# EAGLE design USB_Adapter_V1 (EAGLE 6.5.0)
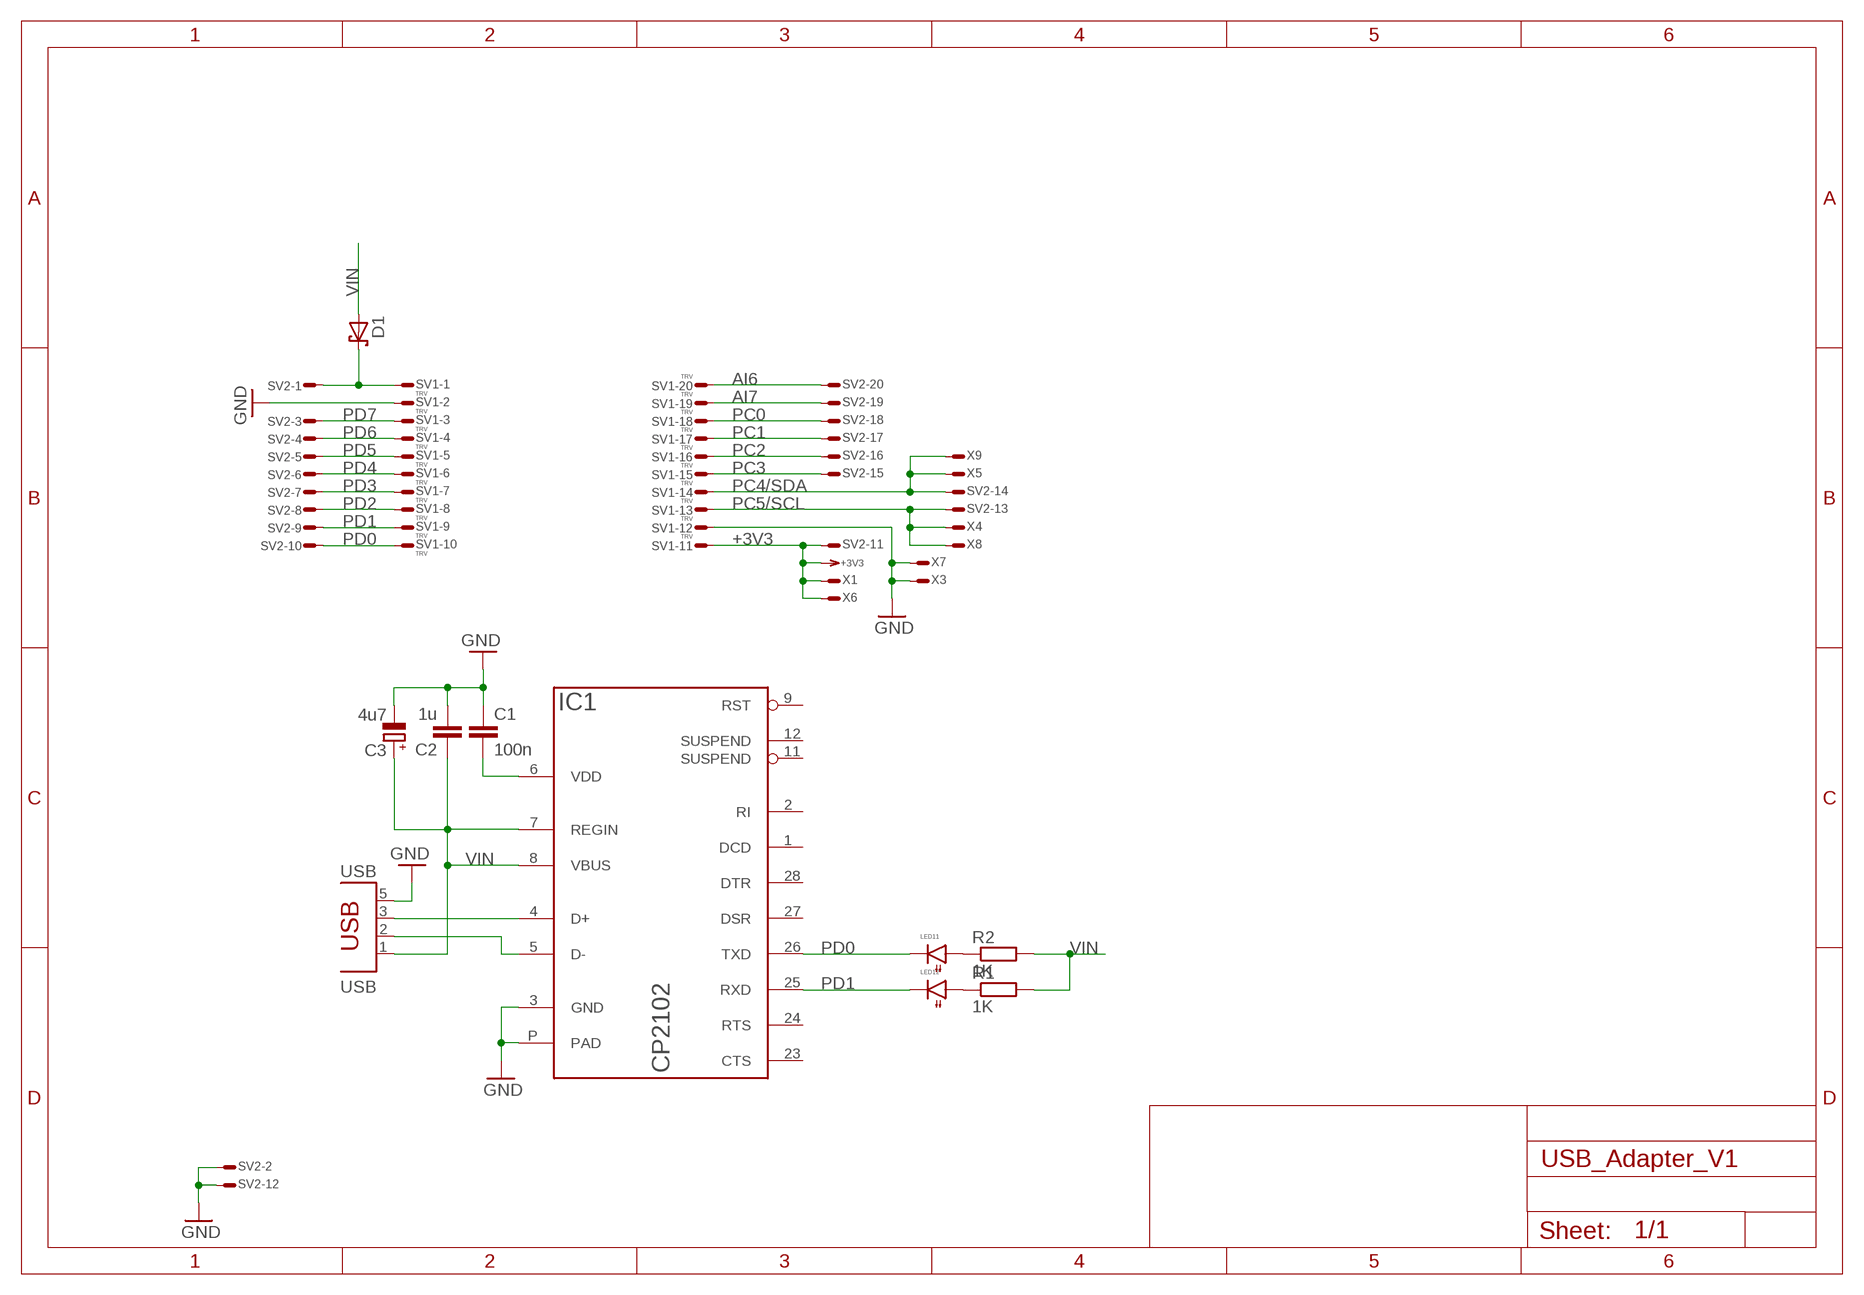
[diagram p0: schematic, sheet 1]

## Parts
C1  100n  C0603  [0603]
C2  1u  C0603  [0603]
C3  4u7  C_POLSMCA  [SMC_A]
D1  D-SCHOTKY323  [SOD323]
IC1  CP2102  [QFN28]
LED1  2LED3  [HSMF]
R1  1K  R0603  [0603]
R2  1K  R0603  [0603]
SV1  TRV  FE20ELSS  [FE10-2WSS]
SV2  ML20SE  [ML20S]
USB  USB  USBBM  [USB-BM]
X1  WIREPADT1.6/0.9  [T1.6/0.9]
X3  WIREPADT1.6/0.9  [T1.6/0.9]
X4  WIREPADT1.6/0.9  [T1.6/0.9]
X5  WIREPADT1.6/0.9  [T1.6/0.9]
X6  WIREPADT1.6/0.9  [T1.6/0.9]
X7  WIREPADT1.6/0.9  [T1.6/0.9]
X8  WIREPADT1.6/0.9  [T1.6/0.9]
X9  WIREPADT1.6/0.9  [T1.6/0.9]

## Nets
+3V3: SV1.P$11 SV2.11 X1.1(S) X6.1(S)
AI6: SV1.P$20 SV2.20
AI7: SV1.P$19 SV2.19
GND: C1.1 C2.2 C3.- IC1.3(GND) IC1.P(PAD) SV1.P$2 SV1.P$12 SV2.2 SV2.12 USB.5(GND) X3.1(S) X7.1(S)
N$1: D1.C SV1.P$1 SV2.1
N$2: C1.2 IC1.6(VDD)
N$3: LED1.3(2:A) R1.1
N$4: IC1.4(D+) USB.3(D+)
N$5: LED1.1(1:A) R2.1
N$6: IC1.5(D-) USB.2(D-)
PC0: SV1.P$18 SV2.18
PC1: SV1.P$17 SV2.17
PC2: SV1.P$16 SV2.16
PC3: SV1.P$15 SV2.15
PC4/SDA: SV1.P$14 SV2.14 X5.1(S) X9.1(S)
PC5/SCL: SV1.P$13 SV2.13 X4.1(S) X8.1(S)
PD0: IC1.26(TXD) LED1.2(1:C) SV1.P$10 SV2.10
PD1: IC1.25(RXD) LED1.4(2:C) SV1.P$9 SV2.9
PD2: SV1.P$8 SV2.8
PD3: SV1.P$7 SV2.7
PD4: SV1.P$6 SV2.6
PD5: SV1.P$5 SV2.5
PD6: SV1.P$4 SV2.4
PD7: SV1.P$3 SV2.3
VIN: C2.1 C3.+ D1.A IC1.7(REGIN) IC1.8(VBUS) R1.2 R2.2 USB.1(VCC)
Unconnected: IC1.1(DCD) IC1.2(RI) IC1.9(RST) IC1.11(SUSPEND) IC1.12(SUSPEND) IC1.23(CTS) IC1.24(RTS) IC1.27(DSR) IC1.28(DTR)

## Library data of the parts
C1 C2 = RCL:C: Capacitor SMD
C3 = RCL:C_POL: POLARIZED CAPACITOR, European symbol
D1 = Diode:D-SCHOTKY: Schottky Diode
IC1 = ICs:CP2102
LED1 = Optic:2LED
R1 R2 = RCL:R: Resistor SMD
SV1 = Conn:FE20E
SV2 = Conn:ML20?E: HARTING
USB = Conn:USB: BERG USB connector
X1 X3-X9 = Conn:WIREPAD: Wire PAD connect wire on PCB

## Board
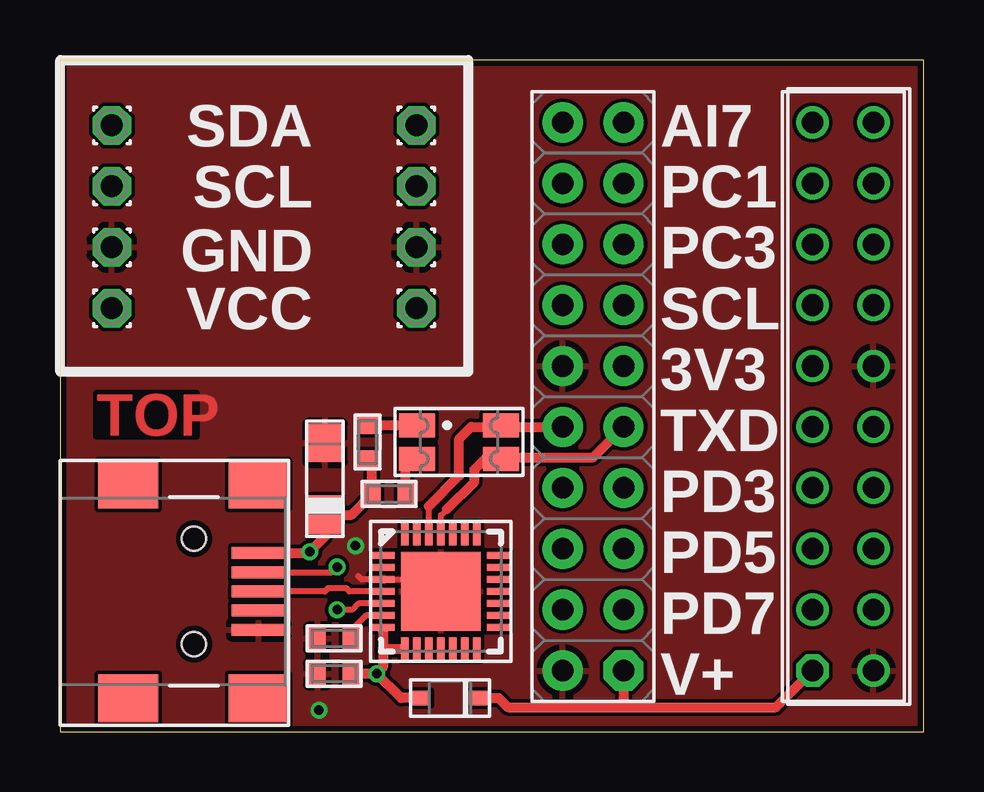
[diagram p1: board, top side]
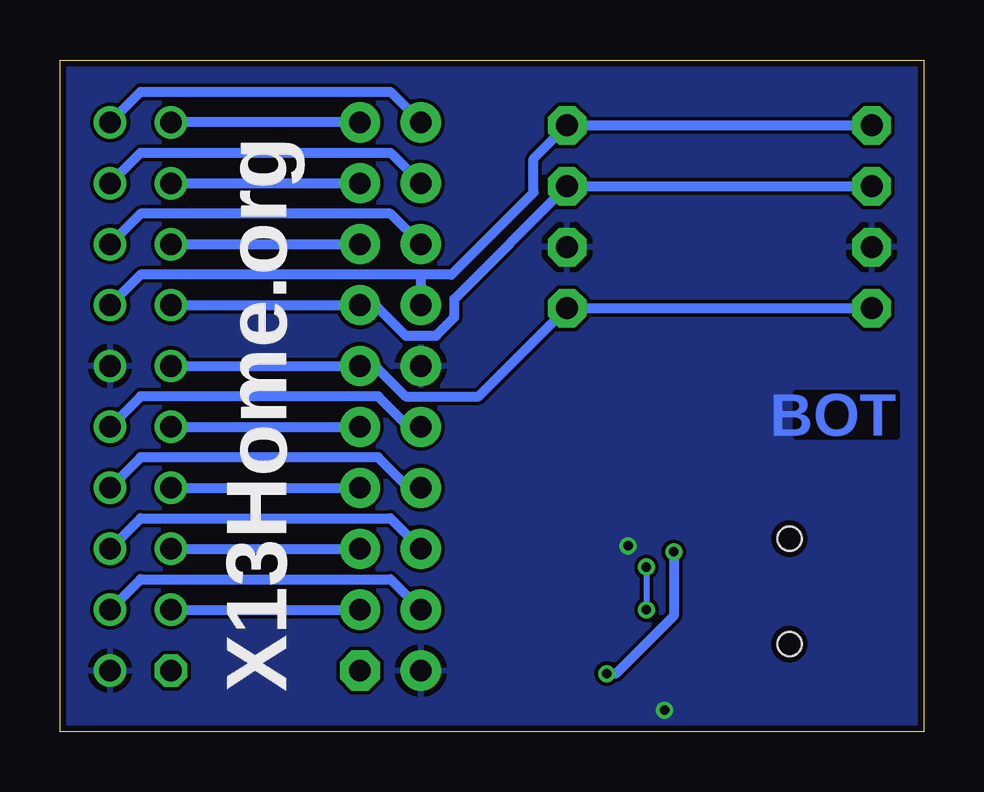
[diagram p2: board, bottom side, seen from below]

Size 36 x 28 mm. Coordinates in mm from the lower left corner, seen from the top.
Outline: 0,28 0,0 36,0 36,28 0,28
Copper layers (1*16): Top 0.035mm / dielectric 0.2mm / Bottom 0.035mm
Design rules "SeeedStudio_DRU_no_angle_20130527 *": minimum track width 6mil, minimum drill 12mil, track to track 6mil, track to pad 6mil, pad to pad 6mil, via to via 6mil, smd to smd 0mil, copper to edge 10mil, drill to drill 10mil, minimum pad ring 6mil, minimum via ring 6mil, stop-mask expansion 2mil, vias tented up to drill 25mil, thermal gap 10mil

### Footprints (pad centres in the part's own frame; a part is rotated, then mirrored left to right if it is on the bottom)
0603 = smd 0.7 x 0.9: 1 -0.697,0; 2 0.697,0
SMC_A = smd 1.6 x 1.4: + -1.5,0; - 1.5,0
SOD323 = smd 0.8 x 0.6: A 1.2,0; C -1.2,0
QFN28 = smd 0.95 x 0.3: 1 -2.4,1.5; 2 -2.4,1; 3 -2.4,0.5; 4 -2.4,0; 5 -2.4,-0.5; 6 -2.4,-1; 7 -2.4,-1.5; 15 2.4,-1.5; 16 2.4,-1; 17 2.4,-0.5; 18 2.4,0; 19 2.4,0.5; 20 2.4,1; 21 2.4,1.5 | smd 0.3 x 0.95: 8 -1.5,-2.4; 9 -1,-2.4; 10 -0.5,-2.4; 11 0,-2.4; 12 0.5,-2.4; 13 1,-2.4; 14 1.5,-2.4; 22 1.5,2.4; 23 1,2.4; 24 0.5,2.4; 25 0,2.4; 26 -0.5,2.4; 27 -1,2.4; 28 -1.5,2.4 | smd 3.3 x 3.3: P 0,0
HSMF = smd 1 x 1.5: 1 -0.7,-1.75; 2 -0.7,1.75; 3 0.7,-1.75; 4 0.7,1.75
FE10-2WSS = drill 0.9 octagon: P$1 -11.43,1.27 | drill 0.9: P$2 -11.43,-1.27; P$3 -8.89,1.27; P$4 -8.89,-1.27; P$5 -6.35,1.27; P$6 -6.35,-1.27; P$7 -3.81,1.27; P$8 -3.81,-1.27; P$9 -1.27,1.27; P$10 -1.27,-1.27; P$11 1.27,1.27; P$12 1.27,-1.27; P$13 3.81,1.27; P$14 3.81,-1.27; P$15 6.35,1.27; P$16 6.35,-1.27; P$17 8.89,1.27; P$18 8.89,-1.27; P$19 11.43,1.27; P$20 11.43,-1.27
ML20S = drill 0.9 pad 1.676 octagon: 1 -11.43,-1.27 | drill 0.9 pad 1.676: 2 -11.43,1.27; 3 -8.89,-1.27; 4 -8.89,1.27; 5 -6.35,-1.27; 6 -6.35,1.27; 7 -3.81,-1.27; 8 -3.81,1.27; 9 -1.27,-1.27; 10 -1.27,1.27; 11 1.27,-1.27; 12 1.27,1.27; 13 3.81,-1.27; 14 3.81,1.27; 15 6.35,-1.27; 16 6.35,1.27; 17 8.89,-1.27; 18 8.89,1.27; 19 11.43,-1.27; 20 11.43,1.27
USB-BM = smd 0.5 x 2.25: 1 -1.6,2.7; 2 -0.8,2.7; 3 0,2.7; 4 0.8,2.7; 5 1.6,2.7 | smd 2 x 2.5: E1 -4.45,-2.75; E2 4.45,-2.75; E3 -4.45,2.7; E4 4.45,2.7 | hole 1: -2.2,0; 2.2,0
T1.6/0.9 = drill 0.914 pad 1.6 octagon: 1 0,0

### Placement (x,y rotation side)
C1  11.43,3.88 0 top
C2  11.43,2.41 180 top
C3  11.05,10.54 90 top
D1  16.26,1.4 180 top
IC1  15.88,5.84 0 top
LED1  16.64,12.06 270 top
R1  13.72,9.91 180 top
R2  12.83,12.06 270 top
SV1  32.64,13.97 90 top
SV2  22.23,13.97 90 top
USB  5.59,5.84 270 top
X1  14.86,17.65 180 top
X3  14.86,20.19 180 top
X4  14.86,22.73 180 top
X5  14.86,25.27 180 top
X6  2.16,17.65 0 top
X7  2.16,20.19 0 top
X8  2.16,22.73 0 top
X9  2.16,25.27 0 top

### Tracks (layer width: path | path; a pad name or v marks a point on that pad's centre or on a via)
+3V3
  Bottom 0.406: SV1.P$11 SV2.11 22.86,15.24 21.59,13.97 18.54,13.97 X1.1 X6.1
AI6
  Bottom 0.406: SV1.P$20 32.64,26.67 22.23,26.67 SV2.20
AI7
  Bottom 0.406: SV2.19 SV1.P$19
GND  (via drill 0.4)
  Top 0.254: IC1.P 15.38,6.34 IC1.3 12.58,6.34 12.45,6.48
  other vias: 10.79,0.89 12.32,7.75
  pour Bottom: 0,28 0,0 36,0 36,28
  pour Top: 0,28 0,0 36,0 36,28
N$1
  Top 0.406: D1.C 18.29,1.4 18.67,1.02 23.5,1.02 | 23.5,1.02 29.84,1.02 SV1.P$1 | SV2.1 23.5,1.02
N$2
  Top 0.254: IC1.6 12.76,4.84 12.12,4.21 12.12,3.89 C1.2
N$3
  Top 0.406: R1.1 14.41,11.27 LED1.3
N$4
  Top 0.254: IC1.4 12.06,5.84 11.94,5.97 11.18,5.97 11.05,5.84 USB.3
N$5
  Top 0.406: LED1.1 R2.1
N$6  (via drill 0.4)
  Top 0.254: USB.2 11.34,6.64 v11.56,6.86 | IC1.5 12.45,5.34 12.19,5.08 v11.56,5.08
  Bottom 0.254: v11.56,6.86 v11.56,5.08
PC0
  Bottom 0.406: SV1.P$18 32.64,24.13 22.23,24.13 SV2.18
PC1
  Bottom 0.406: SV1.P$17 SV2.17
PC2
  Bottom 0.406: SV2.16 22.23,21.59 32.64,21.59 SV1.P$16
PC3
  Bottom 0.406: SV1.P$15 SV2.15
PC4/SDA
  Bottom 0.406: 20.95,19.05 19.68,19.05 16.26,22.48 16.26,23.88 X5.1 X9.1 | 20.95,19.05 32.64,19.05 SV1.P$14 | SV2.14 20.95,19.05
PC5/SCL
  Bottom 0.406: SV1.P$13 SV2.13 22.86,17.78 21.59,16.51 20.32,16.51 19.56,17.27 19.56,18.03 X4.1 X8.1
PD0
  Top 0.254: IC1.26 15.38,9.41
  Top 0.406: 15.37,9.4 15.38,9.41 16.64,10.67 16.64,12.19 17.14,12.7 18.03,12.7 | 18.03,12.7 SV2.10 | LED1.2 18.01,12.73 18.03,12.7
  Bottom 0.406: SV2.10 21.46,12.7 22.73,13.97 32.64,13.97 SV1.P$10
PD1
  Top 0.254: IC1.25 15.88,9.02 16.13,9.27
  Top 0.406: SV2.9 22.23,11.43 18.03,11.43 | 16.13,9.27 17.27,10.41 17.27,10.92 17.78,11.43 18.03,11.43 | LED1.4 18.01,11.4 18.03,11.43
  Bottom 0.406: SV1.P$9 SV2.9
PD2
  Bottom 0.406: SV2.8 21.46,10.16 22.73,11.43 32.64,11.43 SV1.P$8
PD3
  Bottom 0.406: SV1.P$7 SV2.7
PD4
  Bottom 0.406: SV1.P$6 32.64,8.89 22.23,8.89 SV2.6
PD5
  Bottom 0.406: SV1.P$5 SV2.5
PD6
  Bottom 0.406: SV1.P$4 32.64,6.35 22.23,6.35 SV2.4
PD7
  Bottom 0.406: SV1.P$3 SV2.3
VIN  (via drill 0.4)
  Top 0.254: IC1.7 13.47,4.2 13.46,4.19 | IC1.8 14.24,3.44 14.22,3.43
  Top 0.406: v13.21,2.41 C2.1 | 13.46,4.19 13.46,3.43 | 14.22,3.43 13.46,3.43 | 13.46,3.43 13.46,2.67 v13.21,2.41 | USB.1 10.36,7.44 v10.41,7.49 11.05,8.13 C3.+ 12.15,9.04 R1.2 13.02,11.18 R2.2 | D1.A 14.22,1.4 v13.21,2.41
  Bottom 0.406: v10.41,7.49 10.41,4.83 12.83,2.41 v13.21,2.41

### Text on the board
Top: TOP
Bottom: BOT
tNames: SDA | SCL | AI7 | PC1 | GND | VCC | PC3 | SCL | 3V3 | TXD | PD3 | PD5 | PD7 | V+
bNames: X13Home.org